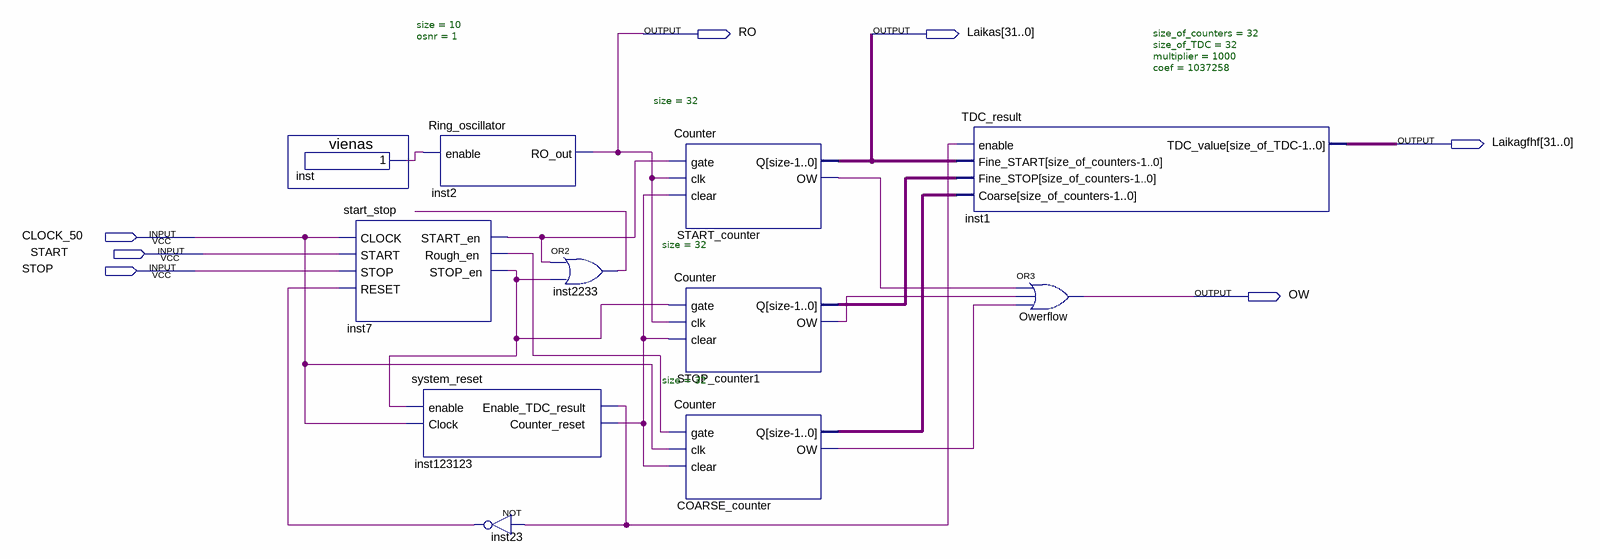
[diagram p0: schematic sheet]
// Quartus schematic testpat.bdf as structural Verilog: 11 symbols, 7 pins
module testpat (
  input  CLOCK_50,
  input  START,
  input  STOP,
  output RO,
  output [31:0] Laikas,
  output [31:0] Laikagfhf,
  output OW
);

  wire COARSE_counter_ow, inst7_rough_en, inst7_start_en, inst7_stop_en, inst23_out, inst2233_out,
       inst123123_counter_reset, inst123123_enable_tdc_result, inst_result, START_counter_ow,
       STOP_counter1_ow;
  wire [31:0] COARSE_counter_q, STOP_counter1_q;

  vienas inst (.result(inst_result));
  start_stop inst7 (
    .CLOCK(CLOCK_50), .START(START), .STOP(STOP), .RESET(inst23_out), .START_en(inst7_start_en),
    .Rough_en(inst7_rough_en), .STOP_en(inst7_stop_en));
  Ring_oscillator #(.size(10), .osnr(1)) inst2 (.enable(inst_result), .RO_out(RO));
  system_reset inst123123 (
    .enable(inst7_stop_en), .Clock(CLOCK_50), .Enable_TDC_result(inst123123_enable_tdc_result),
    .Counter_reset(inst123123_counter_reset));
  not inst23 (inst23_out, inst123123_enable_tdc_result);
  or inst2233 (inst2233_out, inst7_start_en, inst7_stop_en);
  Counter #(.size(32)) START_counter (
    .gate(inst7_start_en), .clk(RO), .clear(inst123123_counter_reset), .Q(Laikas), .OW(START_counter_ow));
  Counter #(.size(32)) STOP_counter1 (
    .gate(inst7_stop_en), .clk(RO), .clear(inst123123_counter_reset), .Q(STOP_counter1_q),
    .OW(STOP_counter1_ow));
  Counter #(.size(32)) COARSE_counter (
    .gate(inst7_rough_en), .clk(CLOCK_50), .clear(inst123123_counter_reset), .Q(COARSE_counter_q),
    .OW(COARSE_counter_ow));
  TDC_result #(.size_of_counters(32), .size_of_TDC(32), .multiplier(1000), .coef(1037258)) inst1 (
    .enable(inst123123_enable_tdc_result), .Fine_START(Laikas), .Fine_STOP(STOP_counter1_q),
    .Coarse(COARSE_counter_q), .TDC_value(Laikagfhf));
  or Owerflow (OW, START_counter_ow, STOP_counter1_ow, COARSE_counter_ow);
endmodule
